# Altium schematic sheet RGB Driver.SchDoc
size B
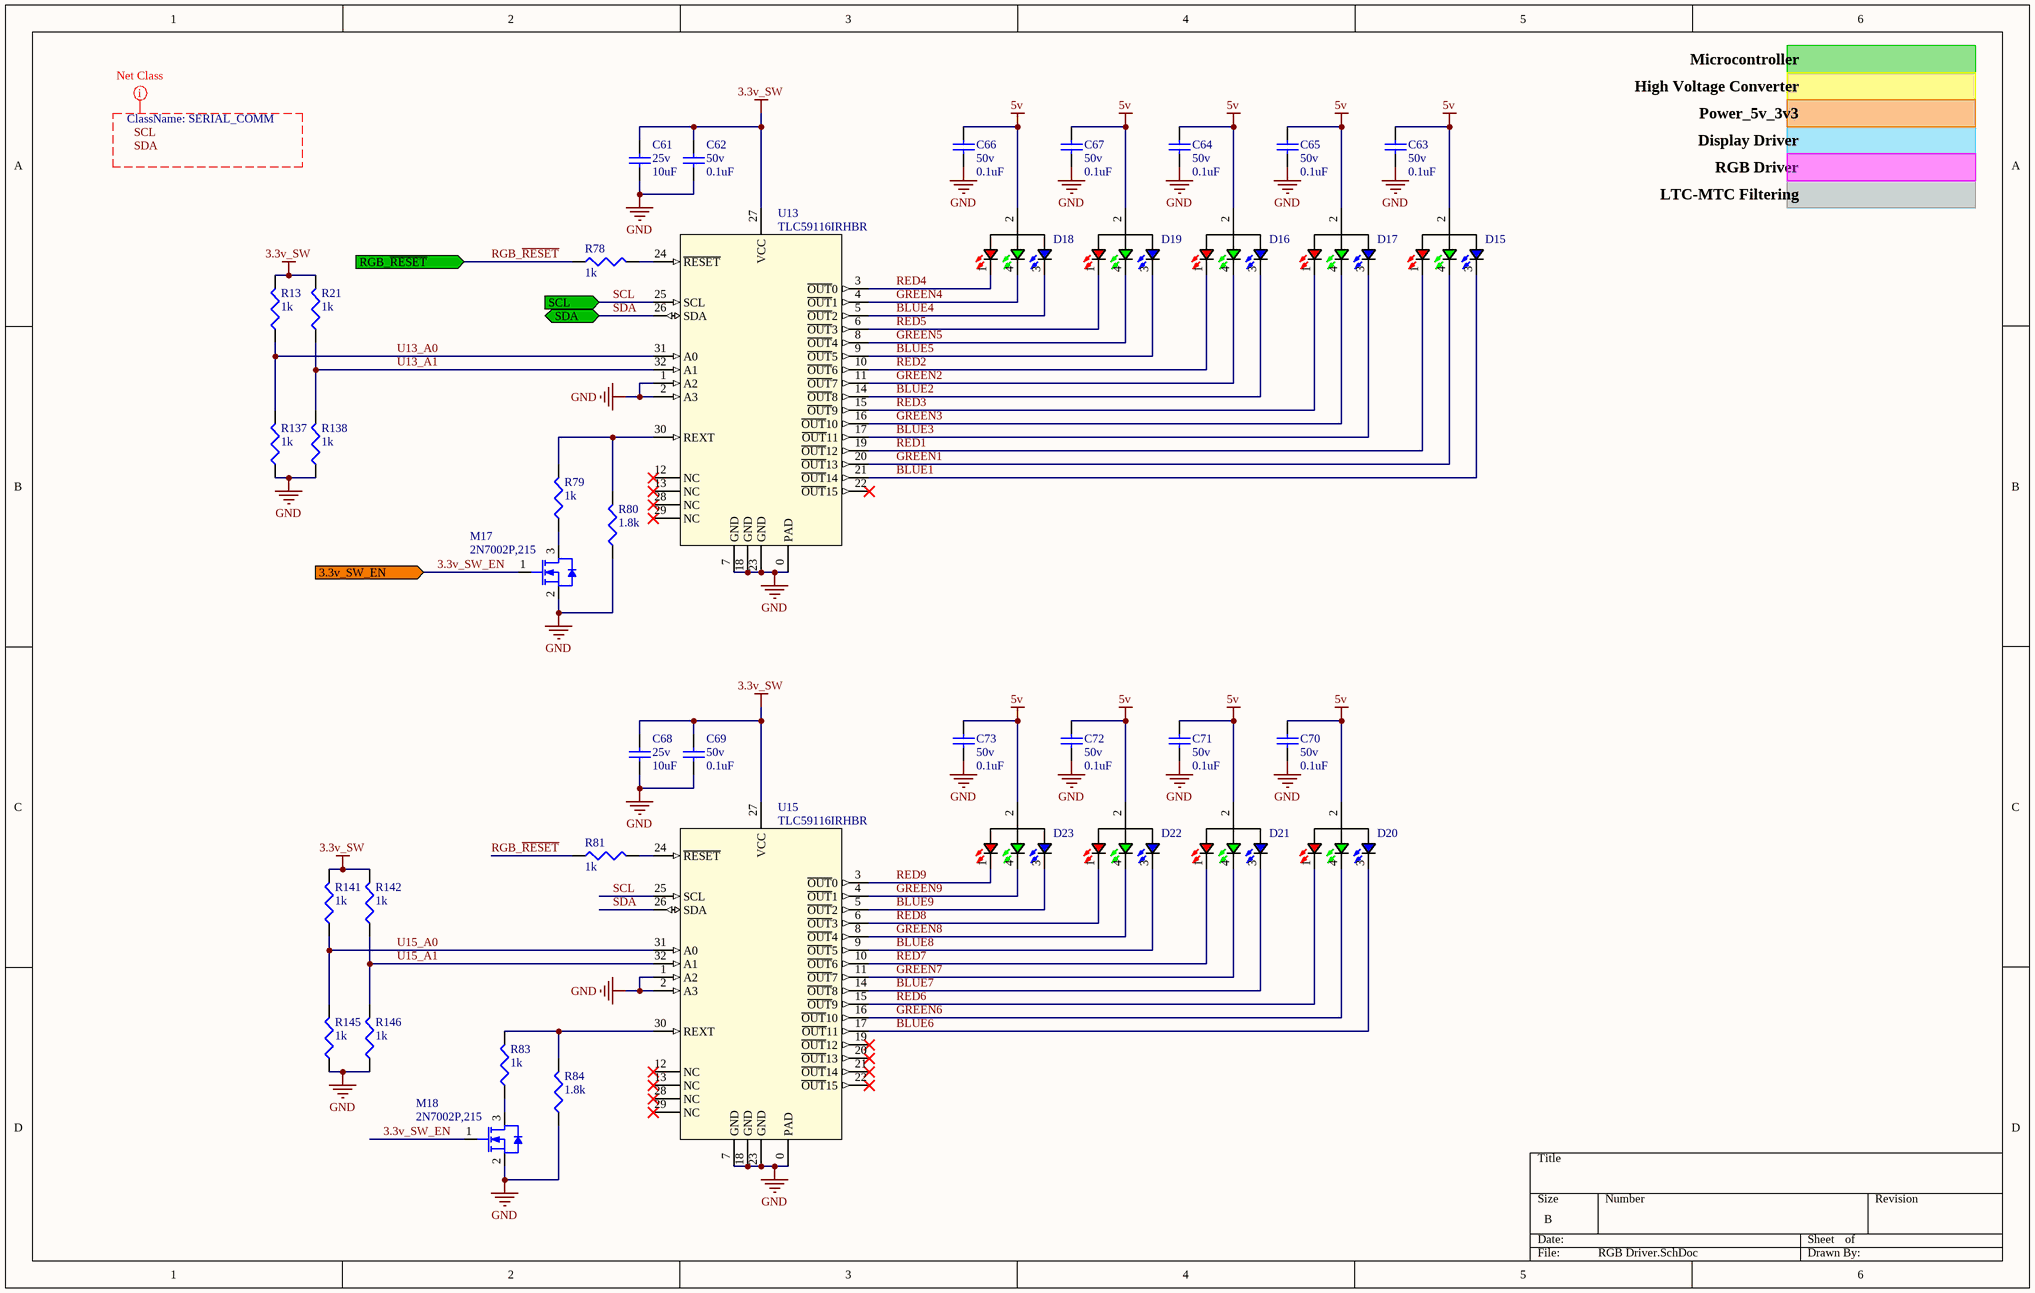
[diagram p0: RGB Driver.SchDoc]

## Parts
C61  Voltage: 25v  [CAP1206R]  (hidden comment: 10uF)
C62  Voltage: 50v  [CAP0603R]  (hidden comment: 0.1uF)
C63  Voltage: 50v  [CAP0603R]  (hidden comment: 0.1uF)
C64  Voltage: 50v  [CAP0603R]  (hidden comment: 0.1uF)
C65  Voltage: 50v  [CAP0603R]  (hidden comment: 0.1uF)
C66  Voltage: 50v  [CAP0603R]  (hidden comment: 0.1uF)
C67  Voltage: 50v  [CAP0603R]  (hidden comment: 0.1uF)
C68  Voltage: 25v  [CAP1206R]  (hidden comment: 10uF)
C69  Voltage: 50v  [CAP0603R]  (hidden comment: 0.1uF)
C70  Voltage: 50v  [CAP0603R]  (hidden comment: 0.1uF)
C71  Voltage: 50v  [CAP0603R]  (hidden comment: 0.1uF)
C72  Voltage: 50v  [CAP0603R]  (hidden comment: 0.1uF)
C73  Voltage: 50v  [CAP0603R]  (hidden comment: 0.1uF)
D15  XZMDKCBDDG45S-9  [XZMDKCBDDG45S-9]  (value not drawn)
D16  XZMDKCBDDG45S-9  [XZMDKCBDDG45S-9]  (value not drawn)
D17  XZMDKCBDDG45S-9  [XZMDKCBDDG45S-9]  (value not drawn)
D18  XZMDKCBDDG45S-9  [XZMDKCBDDG45S-9]  (value not drawn)
D19  XZMDKCBDDG45S-9  [XZMDKCBDDG45S-9]  (value not drawn)
D20  XZMDKCBDDG45S-9  [XZMDKCBDDG45S-9]  (value not drawn)
D21  XZMDKCBDDG45S-9  [XZMDKCBDDG45S-9]  (value not drawn)
D22  XZMDKCBDDG45S-9  [XZMDKCBDDG45S-9]  (value not drawn)
D23  XZMDKCBDDG45S-9  [XZMDKCBDDG45S-9]  (value not drawn)
M17  2N7002P,215  [SOT23-3M]
M18  2N7002P,215  [SOT23-3M]
R13  1k  [RES0402R]
R21  1k  [RES0402R]
R78  1k  [RES0402R]
R79  1k  [RES0402R]
R80  1.8k  [RES0402R]
R81  1k  [RES0402R]
R83  1k  [RES0402R]
R84  1.8k  [RES0402R]
R137  1k  [RES0402R]
R138  1k  [RES0402R]
R141  1k  [RES0402R]
R142  1k  [RES0402R]
R145  1k  [RES0402R]
R146  1k  [RES0402R]
U13  TLC59116IRHBR  [QFN32]
U15  TLC59116IRHBR  [QFN32]

## Ports
3.3v_SW_EN (in), RGB_~{RESET} (in), SCL (in), SDA (bidir)

## Nets
3.3v_SW: C61.1 C62.2 C68.1 C69.2 R13.2 R21.2 R141.2 R142.2 U13.27(VCC) U15.27(VCC)
5v: C63.1 C64.1 C65.1 C66.1 C67.1 C70.1 C71.1 C72.1 C73.1 D15.2(COMMON) D16.2(COMMON) D17.2(COMMON) D18.2(COMMON) D19.2(COMMON) D20.2(COMMON) D21.2(COMMON) D22.2(COMMON) D23.2(COMMON)
GND: C61.2 C62.1 C63.2 C64.2 C65.2 C66.2 C67.2 C68.2 C69.1 C70.2 C71.2 C72.2 C73.2 M17.2(SOURCE) M18.2(SOURCE) R80.1 R84.1 R137.1 R138.1 R145.1 R146.1 U13.0(PAD) U13.1(A2) U13.2(A3) U13.7(GND) U13.18(GND) U13.23(GND) U15.0(PAD) U15.1(A2) U15.2(A3) U15.7(GND) U15.18(GND) U15.23(GND)
3.3v_SW_EN: M17.1(GATE) M18.1(GATE) ; port 3.3v_SW_EN
BLUE1: D15.3(B) U13.21(~{OUT}14)
BLUE2: D16.3(B) U13.14(~{OUT}8)
BLUE3: D17.3(B) U13.17(~{OUT}11)
BLUE4: D18.3(B) U13.5(~{OUT}2)
BLUE5: D19.3(B) U13.9(~{OUT}5)
BLUE6: D20.3(B) U15.17(~{OUT}11)
BLUE7: D21.3(B) U15.14(~{OUT}8)
BLUE8: D22.3(B) U15.9(~{OUT}5)
BLUE9: D23.3(B) U15.5(~{OUT}2)
GREEN1: D15.4(G) U13.20(~{OUT}13)
GREEN2: D16.4(G) U13.11(~{OUT}7)
GREEN3: D17.4(G) U13.16(~{OUT}10)
GREEN4: D18.4(G) U13.4(~{OUT}1)
GREEN5: D19.4(G) U13.8(~{OUT}4)
GREEN6: D20.4(G) U15.16(~{OUT}10)
GREEN7: D21.4(G) U15.11(~{OUT}7)
GREEN8: D22.4(G) U15.8(~{OUT}4)
GREEN9: D23.4(G) U15.4(~{OUT}1)
RED1: D15.1(R) U13.19(~{OUT}12)
RED2: D16.1(R) U13.10(~{OUT}6)
RED3: D17.1(R) U13.15(~{OUT}9)
RED4: D18.1(R) U13.3(~{OUT}0)
RED5: D19.1(R) U13.6(~{OUT}3)
RED6: D20.1(R) U15.15(~{OUT}9)
RED7: D21.1(R) U15.10(~{OUT}6)
RED8: D22.1(R) U15.6(~{OUT}3)
RED9: D23.1(R) U15.3(~{OUT}0)
RGB_~{RESET}: R78.1 R81.1 ; port RGB_~{RESET}
SCL: U13.25(SCL) U15.25(SCL) ; port SCL
SDA: U13.26(SDA) U15.26(SDA) ; port SDA
U13_A0: R13.1 R137.2 U13.31(A0)
U13_A1: R21.1 R138.2 U13.32(A1)
U15_A0: R141.1 R145.2 U15.31(A0)
U15_A1: R142.1 R146.2 U15.32(A1)
NetM17_3: M17.3(DRAIN) R79.1
NetM18_3: M18.3(DRAIN) R83.1
NetR78_2: R78.2 U13.24(~{RESET})
NetR79_2: R79.2 R80.2 U13.30(REXT)
NetR81_2: R81.2 U15.24(~{RESET})
NetR83_2: R83.2 R84.2 U15.30(REXT)

Not connected (* = marked no-connect by the designer): U13 12(NC)* 13(NC)* 22(~{OUT}15)* 28(NC)* 29(NC)*; U15 12(NC)* 13(NC)* 19(~{OUT}12)* 20(~{OUT}13)* 21(~{OUT}14)* 22(~{OUT}15)* 28(NC)* 29(NC)*

## Layout directives
net class SERIAL_COMM: SCL, SDA

## Notes on the sheet
- Microcontroller
- High Voltage Converter
- Display Driver
- Power_5v_3v3
- RGB Driver
- LTC-MTC Filtering
- Labels drawn without touching a wire or pin: SCL, SDA

## Library data of the parts
C61 C68 = 10uF 25v (1206): Tolerance: 10%; MFG_PN: GRJ31CR71E106KE11L; MFG: MURATA; LOAD: NL; Value: 10uF
C62-C67 C69-C73 = 0.1uF 50v (0603): MFG_PN: VJ0603V104ZXAPW1BC; MFG: Vishay; LOAD: NL; Value: 0.1uF
D15-D23 = XZMDKCBDDG45S-9: Reverse Gullwing RGB LED; MFG: SUN LED; VOLTAGE RED: 1.95v; VOLTAGE GREEN: 3.3v; CURRENT: 30mA; MFG_PN: XZMDKCBDDG45S-9; VOLTAGE BLUE: 3.3v
M17 M18 = 2N7002: NFET_SINGLE_360mA_60V; LOAD: NL; MFG: NXP; VDS_MAX: 60v; I_MAX: 360mA; VGS_MAX: 20v; P_MAX: *; RDS_ON: *; MFG_PN: 2N7002P,215
R13 R21 R78 R79 R81 R83 R137 R138 R141 R142 R145 R146 = 1k (0402): Tolerance: 1%; POWER: 63mW; MFG_PN: CRCW04021K00FKED; MFG: Vishay; Load: NL; Value: 1k
R80 R84 = 1.8k (0402): Tolerance: 1%; POWER: 63mW; MFG_PN: CRCW04021K80FKED; MFG: Vishay; Load: NL; Value: 1.8k
U13 U15 = TLC59116IRHBR: LED Driver, 16ch, Individual dimming; MFG: TI; CHANNELS: 16; CURRENT: 120mA; COMM: I2C; MFG_PN: TLC59116IRHBR